# Altium schematic sheet smartGarden_Pow_Rev01.SchDoc
size A4
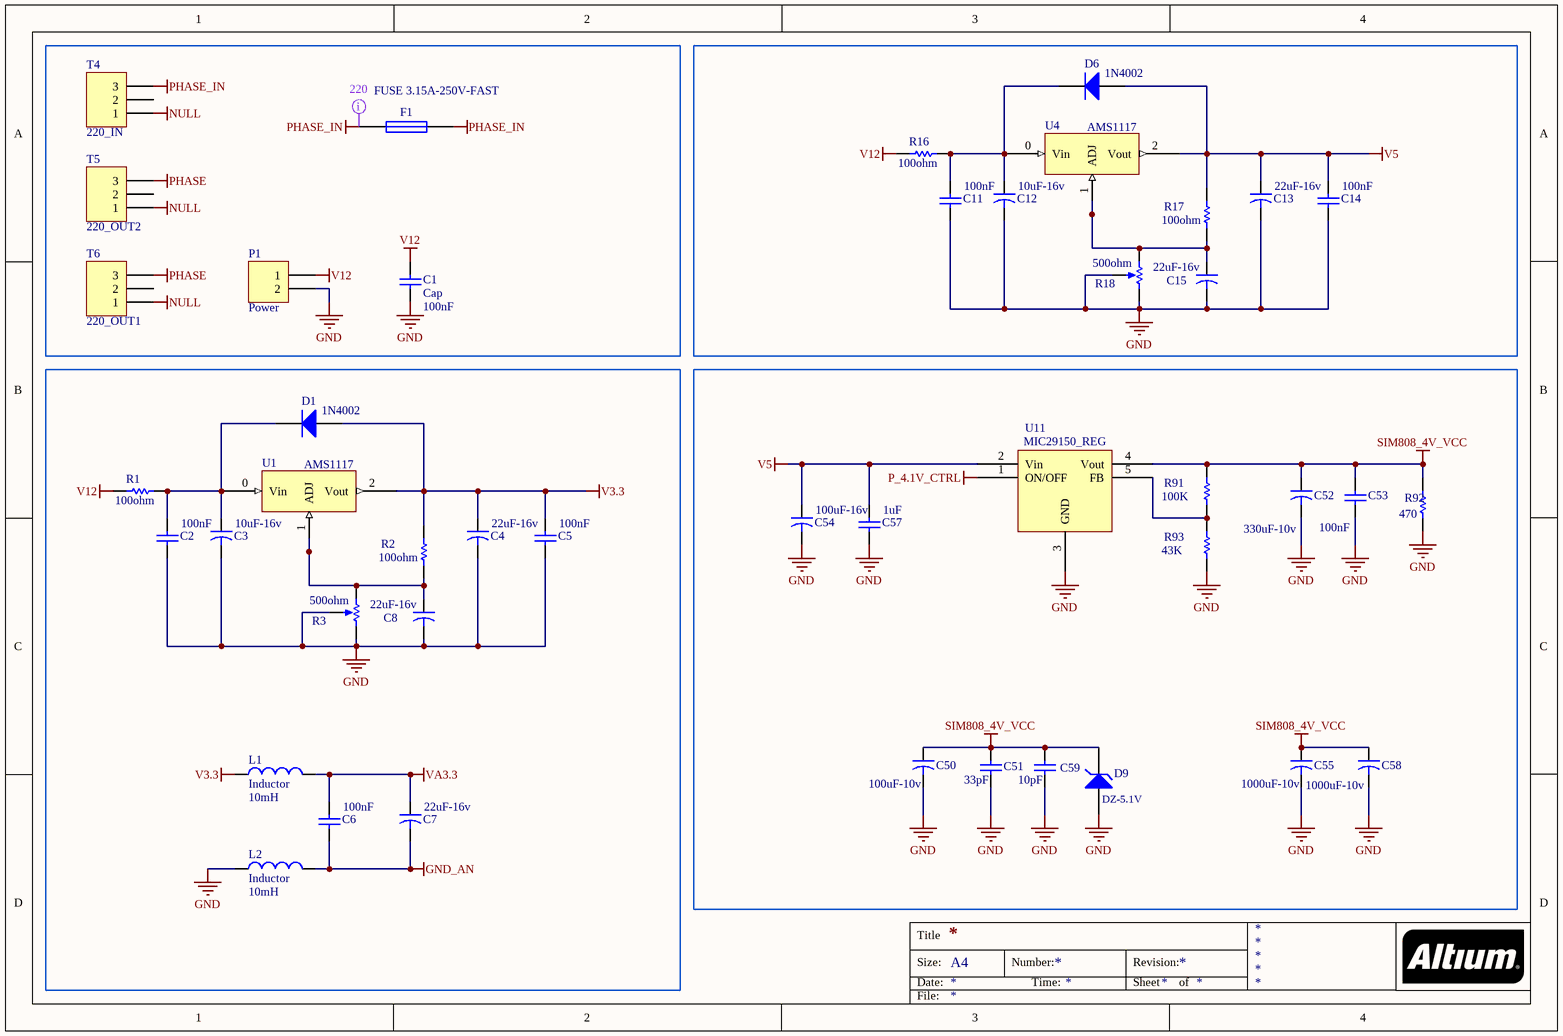
[diagram p0: smartGarden_Pow_Rev01.SchDoc]

## Parts
C1  Cap  value 100nF  [0805_smd]
C2  value 100nF  [0805_smd]  (hidden comment: Cap)
C3  value 10uF-16v  [CAPR5-4X5]  (hidden comment: Cap2)
C4  value 22uF-16v  [C100uF/25V]  (hidden comment: Cap2)
C5  value 100nF  [0805_smd]  (hidden comment: Cap)
C6  value 100nF  [0805_smd]  (hidden comment: Cap)
C7  value 22uF-16v  [C100uF/25V]  (hidden comment: Cap2)
C8  value 22uF-16v  [C100uF/25V]  (hidden comment: Cap2)
C11  value 100nF  [0805_smd]  (hidden comment: Cap)
C12  value 10uF-16v  [CAPR5-4X5]  (hidden comment: Cap2)
C13  value 22uF-16v  [C100uF/25V]  (hidden comment: Cap2)
C14  value 100nF  [0805_smd]  (hidden comment: Cap)
C15  value 22uF-16v  [C100uF/25V]  (hidden comment: Cap2)
C50  value 100uF-10v  [CAPR5-4X5]  (hidden comment: Cap2)
C51  33pF  [0805_smd]
C52  value 330uF-10v  [CAPR5-4X5]  (hidden comment: Cap2)
C53  value 100nF  [0805_smd]  (hidden comment: Cap)
C54  value 100uF-16v  [C100uF/25V]  (hidden comment: Cap2)
C55  value 1000uF-10v  [CAPR5-4X5]  (hidden comment: Cap2)
C57  value 1uF  [0805_smd]  (hidden comment: Cap)
C58  value 1000uF-10v  [CAPR5-4X5]  (hidden comment: Cap2)
C59  10pF  [0805_smd]
D1  1N4002  [7227_SMD]
D6  1N4002  [7227_SMD]
D9  DZ-5.1V  [MLL34_SMD]
F1  FUSE 3.15A-250V-FAST  [FUSE1]
L1  Inductor  value 10mH  [0402-A]
L2  Inductor  value 10mH  [0402-A]
P1  Power  [PCON_L2]
R1  value 100ohm  [1206_SMD]  (hidden comment: Res1)
R2  value 100ohm  [0805_smd]  (hidden comment: Res1)
R3  value 500ohm  [Trimmer Pot]  (hidden comment: RPot)
R16  value 100ohm  [1206_SMD]  (hidden comment: Res1)
R17  value 100ohm  [0805_smd]  (hidden comment: Res1)
R18  value 500ohm  [Trimmer Pot]  (hidden comment: RPot)
R91  value 100K  [0805_smd]  (hidden comment: Res1)
R92  value 470  [1206_SMD]  (hidden comment: Res1)
R93  value 43K  [0805_smd]  (hidden comment: Res1)
T4  220_IN  [PCON_L3]
T5  220_OUT2  [PCON_L3]
T6  220_OUT1  [PCON_L3]
U1  AMS1117  [SOT223]
U4  AMS1117  [SOT223]
U11  MIC29150_REG

## Nets
GND: C1.1 C2.1 C3.2 C4.2 C5.1 C8.2 C11.1 C12.2 C13.2 C14.1 C15.2 C50.2 C51.1 C52.2 C53.1 C54.2 C55.2 C57.1 C58.2 C59.1 D9.A L2.1 P1.2 R3.2(BOT) R3.3(TAP) R18.2(BOT) R18.3(TAP) R92.1 R93.1 U11.3(GND)
GND_AN: C6.1 C7.2 L2.2
NULL: T4.1 T5.1 T6.1
P_4.1V_CTRL: U11.1(ON/OFF)
PHASE: T5.3 T6.3
PHASE_IN: F1.1 F1.2 T4.3
SIM808_4V_VCC: C50.1 C51.2 C52.1 C53.2 C55.1 C58.1 C59.2 D9.K R91.2 R92.2 U11.4(Vout)
V3.3: C4.1 C5.2 D1.1(A) L1.1 R2.2 U1.2(Vout)
V5: C13.1 C14.2 C54.1 C57.2 D6.1(A) R17.2 U4.2(Vout) U11.2(Vin)
V12: C1.2 P1.1 R1.2 R16.2
VA3.3: C6.2 C7.1 L1.2
NetC2_2: C2.2 C3.1 D1.2(K) R1.1 U1.0(Vin)
NetC8_1: C8.1 R2.1 R3.1(TOP) U1.1(ADJ)
NetC11_2: C11.2 C12.1 D6.2(K) R16.1 U4.0(Vin)
NetC15_1: C15.1 R17.1 R18.1(TOP) U4.1(ADJ)
NetR91_1: R91.1 R93.2 U11.5(FB)

Not connected (* = marked no-connect by the designer): T4 2; T5 2; T6 2

## Layout directives
net class 220: PHASE_IN

## Notes on the sheet
- Title
- Size:
- Date:
- A4
- Number:
- Time:
- Revision:
- Sheet
- of
- File:

## Library data of the parts
C1 C2 C5 C6 C11 C14 C53 C57 = Cap: Capacitor; Published: 8-Jun-2000; LatestRevisionDate: 17-Jul-2002; LatestRevisionNote: Re-released for DXP Platform.; PackageReference: RAD-0.3; Publisher: Altium Limited; PackageDescription: Radial Cap, Thru-Hole; 2 Leads; 0.3 in Pin Spacing
C3 C4 C7 C8 C12 C13 C15 C50 C52 C54 C55 C58 = Cap2: Capacitor; Published: 23-Sep-2002; PackageReference: CAPR5-4X5; Publisher: Altium Limited; PackageDescription: Capacitor; 2 Leads
C51 C59 = Cap: Capacitor; Value: 100u; Published: 8-Jun-2000; LatestRevisionDate: 17-Jul-2002; LatestRevisionNote: Re-released for DXP Platform.; PackageReference: RAD-0.3; Publisher: Altium Limited
D1 D6 = Diode 1N4002: 1 Amp General Purpose Rectifier; Published: 8-Jun-2000; LatestRevisionDate: 17-Jul-2002; LatestRevisionNote: Re-released for DXP Platform.; DatasheetVersion: 1998; PackageVersion: Aug-1999; PackageReference: DO-41; Publisher: Altium Limited; PackageDescription: Diode, Axial; Body 5.2 x 2.7 mm (LxDia. max), Lead Dia. 0.86 mm (max); Code_JEDEC: DO-204-AL; ComponentLink1Description: Manufacturer Link; ComponentLink1URL: http://www.fairchildsemi.com/; ComponentLink2Description: Datasheet; ComponentLink2URL: http://www.fairchildsemi.com/ds/1N%2F1N4001.pdf
D9 = D Zener: Zener Diode; Published: 8-Jun-2000; LatestRevisionDate: 17-Jul-2002; LatestRevisionNote: Re-released for DXP Platform.; PackageReference: DIODE-0.7; Publisher: Altium Limited
F1 = FUSE1: Fuse
L1 L2 = Inductor: Code_IEC: 1005; Published: 8-Jun-2000; LatestRevisionDate: 29-May-2009; LatestRevisionNote: IPC-7351 Footprint Added.; PackageReference: 0402-A; Publisher: Altium Limited; PackageDescription: Chip Inductor; Code_JEITA: 0402
P1 = Header 2: Header, 2-Pin; LatestRevisionDate: 17-Jul-2002; LatestRevisionNote: Re-released for DXP Platform.; Publisher: Altium Limited
R1 R2 R16 R17 R91-R93 = Res1: Resistor; Published: 8-Jun-2000; LatestRevisionDate: 17-Jul-2002; LatestRevisionNote: Re-released for DXP Platform.; PackageReference: AXIAL-0.3; Publisher: Altium Limited; PackageDescription: Axial Device, Thru-Hole; 2 Leads; 0.3 in Pin Spacing
R3 R18 = RPot: Potentiometer; Sim Note: Enter the Resistance value and the set point into parameter fields.; Set Position: 0.5; Published: 8-Jun-2000; LatestRevisionDate: 17-Jul-2002; LatestRevisionNote: Re-released for DXP Platform.; PackageReference: VR5; Publisher: Altium Limited; PackageDescription: Variable Resistor, Thru-Hole; 3 Leads
T4-T6 = Header 3: Header, 3-Pin; LatestRevisionDate: 17-Jul-2002; LatestRevisionNote: Re-released for DXP Platform.; Publisher: Altium Limited
U1 U4 = AMS1117: pin to pad: 0>3